# Altium schematic sheet pwr.SchDoc: =ProjectName+'_'+ProjectRevision+'_'+VariantName
size A3; DocumentNumber: 2; SheetNumber: 2; SheetTotal: 5
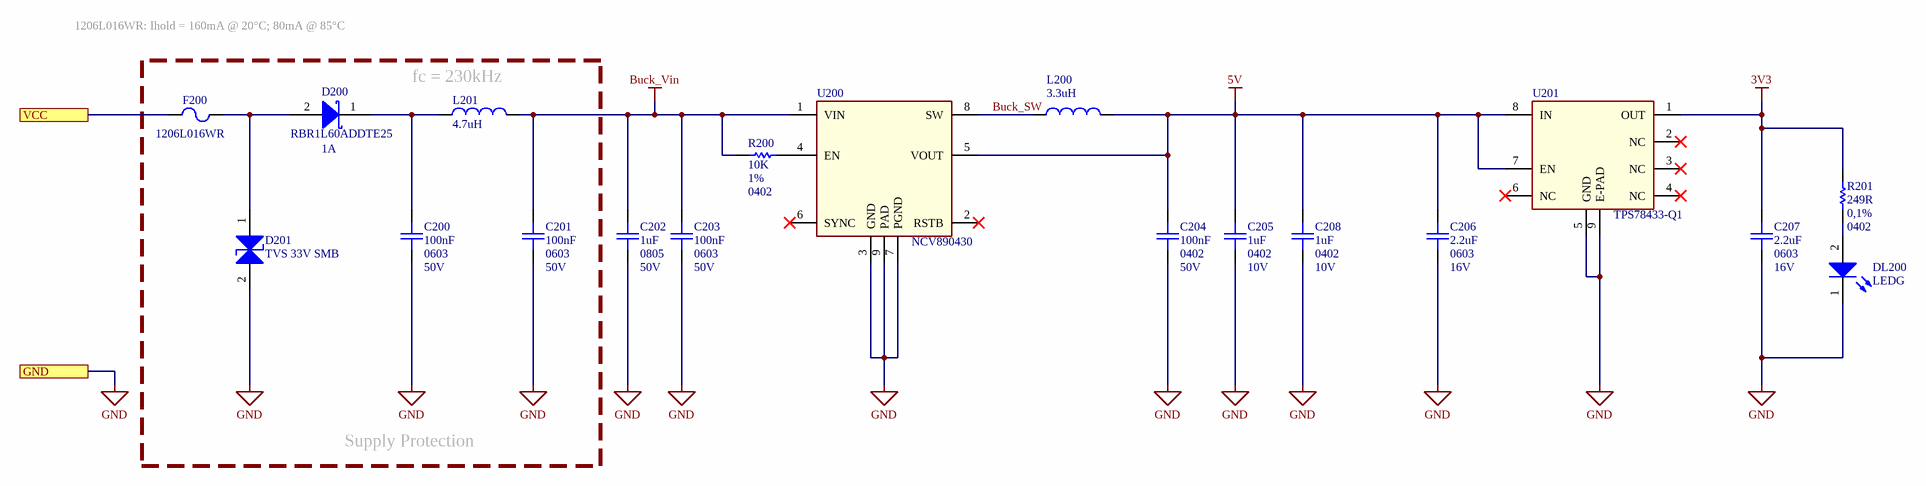
[diagram p0: pwr.SchDoc]

## Parts
C200  Case/Package: 0603  Op Voltage: 50V  [CER0603]  (hidden comment: 100nF)
C201  Case/Package: 0603  Op Voltage: 50V  [CER0603]  (hidden comment: 100nF)
C202  Case/Package: 0805  Op Voltage: 50V  [CER0805]  (hidden comment: 1uF)
C203  Case/Package: 0603  Op Voltage: 50V  [CER0603]  (hidden comment: 100nF)
C204  Case/Package: 0402  Op Voltage: 50V  [CER0402]  (hidden comment: 100nF)
C205  Case/Package: 0402  Op Voltage: 10V  [CER0402]  (hidden comment: 1uF)
C206  Case/Package: 0603  Op Voltage: 16V  [CER0603]  (hidden comment: 2.2uF)
C207  Case/Package: 0603  Op Voltage: 16V  [CER0603]  (hidden comment: 2.2uF)
C208  Case/Package: 0402  Op Voltage: 10V  [CER0402]  (hidden comment: 1uF)
D200  value RBR1L60ADDTE25  If (A): 1A  [DO-214AC_SMA]  (hidden comment: Shottky Rect Diode SMD)
D201  value TVS 33V SMB  [DO-214AA_SMB]  (hidden comment: SMD/PTH TVS Bidirectional Diode)
DL200  value LEDG  [LED SMD 0603]  (hidden comment: Single Color SMD LED)
F200  value 1206L016WR  [FUSC3216X125N]  (hidden comment: Fuse_PTCRes)
L200  value 3.3uH  [WE-MAPI_1212]  (hidden comment: SMD Inductor)
L201  value 4.7uH  [WE-LQ_1210]  (hidden comment: SMD Inductor)
R200  value 10K  Tolerance: 1%  Case/Package: 0402  [Res0402]  (hidden comment: SMD Resistor)
R201  value 249R  Tolerance: 0,1%  Case/Package: 0402  [Res0402]  (hidden comment: SMD Resistor)
U200  value NCV890430  [SON65P300X300X100-9N]  (hidden comment: ONSEMI_NCV890430)
U201  value TPS78433-Q1  [SON65P300X100_HS-9N_NOPAD]  (hidden comment: TI_TPS78533Q_VSON)

## Ports
GND, VCC

## Nets
3V3: C207.1 R201.2 U201.1(OUT)
5V: C204.1 C205.1 C206.1 C208.1 L200.2 U200.5(VOUT) U201.7(EN) U201.8(IN)
Buck_Vin: C201.1 C202.1 C203.1 L201.2 R200.2 U200.1(VIN)
GND: C200.2 C201.2 C202.2 C203.2 C204.2 C205.2 C206.2 C207.2 C208.2 D201.2(K) DL200.1(K) U200.3(GND) U200.7(PGND) U200.9(PAD) U201.5(GND) U201.9(E-PAD) ; port GND
Buck_SW: L200.1 U200.8(SW)
VCC: F200.1 ; port VCC
NetC200_1: C200.1 D200.1(K) L201.1
NetD200_2: D200.2(A) D201.1(A) F200.2
NetDL200_2: DL200.2(A) R201.1
NetR200_1: R200.1 U200.4(EN)

Not connected (* = marked no-connect by the designer): U200 2(RSTB)* 6(SYNC)*; U201 2(NC)* 3(NC)* 4(NC)* 6(NC)*

## Notes on the sheet
- 1206L016WR: Ihold = 160mA @ 20°C; 80mA @ 85°C
- (near L201) fc = 230kHz
- Supply Protection
- Proj
- Title:
- Approved:
- Sheet
- File Name:
- Rev:
- Author:
- Date:
- Size:
- A3
- Number:

## Library data of the parts
C200 C201 C203 = GCM188L81H104KA57D: MLCC Automotive, 100nF, 0603, 50V, 10%, X8L; MFG1: MURATA; Min Op# Temp °C: -55; Max Op# temp °C: 150; Qualification: AEC-Q200; MPN1: GCM188L81H104KA57D; Value: 100nF; MFG2: MURATA; MPN2: GCJ188L8EL104KA07; Tolerance: 10%; Dielectric: X8L; Supplier: Mouser; Supplier Part Number: 81-GCM188L81H104KA7D; Supplier URL: https://www.mouser.it/ProductDetail/Murata-Electronics/GCM188L81H104KA57J?qs=yTuLhIm%2Fv1CdnQNNqnCjYQ%3D%3D; Datasheet URL: https://www.mouser.it/datasheet/2/281/1/GCM188L81H104KA57_01A-3144042.pdf; Termination: Soft (GCJ); Technology: Powertrain/Safety for Automotive
C202 = KAM21KR71H105KL: MLCC Automotive, 1uF, 0805, 50V, 10%, X7R; MFG1: KYOCERA-AVX; Min Op# Temp °C: -55; Max Op# temp °C: 125; Qualification: AEC-Q200; MPN1: KAM21KR71H105KL; Value: 1uF; Tolerance: 10%; Dielectric: X7R; Supplier: Mouser; Supplier Part Number: 581-KAM21KR71H105KL; Supplier URL: https://www.mouser.it/ProductDetail/KYOCERA-AVX/08055C105K4T4A?qs=byeeYqUIh0Oh891bMlItEA%3D%3D; Datasheet URL: https://www.mouser.it/datasheet/2/40/AutoMLCC-2952695.pdf; Technology: Powertrain/Safety for Automotive
C204 = GCM155R71H104KE02D: MLCC Automotive, 100nF, 0402, 50V, 10%, X7r; MFG1: MURATA; Min Op# Temp °C: -55; Max Op# temp °C: 125; Qualification: AEC-Q200; MPN1: GCM155R71H104KE02D; Value: 100nF; MFG2: MURATA; MPN2: GCM155R71H104KE37; Tolerance: 10%; Dielectric: X7R; Supplier: Mouser; Supplier Part Number: 81-GCM155R71H104KE2D; Supplier URL: https://www.mouser.it/ProductDetail/Murata-Electronics/GCM155R71H104KE02D?qs=hNud%2FORuBR2sLZsqfoz4Fw%3D%3D; Datasheet URL: https://www.mouser.it/datasheet/2/281/1/GCM155R71H104KE02_01A-3142168.pdf; Technology: Powertrain/Safety for Automotive
C205 C208 = GCM155C71A105ME38D: MLCC Automotive, 1uF, 0402, 10V, 20%, X7S; MFG1: MURATA; Tolerance: 20.00%; Min Op# Temp °C: -55; Max Op# temp °C: 125; Qualification: AEC-Q200; MPN1: GCM155C71A105ME38D; Value: 1uF; Dielectric: X7S; Supplier: Mouser; Supplier Part Number: 81-GCM155C71A105ME8D; Supplier URL: https://www.mouser.it/it/ProductDetail/Murata-Electronics/GCM155C71A105ME38D?qs=sGAEpiMZZMvsSlwiRhF8qiE2qjJvMbsZOkfRw1uqIZmZq%252BZnnVO3gA%3D%3D; Datasheet URL: https://pim.murata.com/asset/pim4/ceramicCapacitorSMD/GCM155C71A105ME38-01A-EN_PDF_CERAMICCAPACITORSMD
C206 C207 = GRT188C71C225KE13D: MLCC Automotive, 2.2uF, 0603, 16V, 10%, X7S; MFG1: MURATA; Min Op# Temp °C: -55; Max Op# temp °C: 125; Qualification: AEC-Q200; MPN1: GRT188C71C225KE13D; Value: 2.2uF; Tolerance: 10%; Dielectric: X7S; Supplier: Mouser; Supplier Part Number: 81-GRT188C71C225KE3D; Supplier URL: https://www.mouser.it/it/ProductDetail/Murata-Electronics/GRT188C71C225KE13D?qs=hd1VzrDQEGhlNcWcmqnE6Q%3D%3D; Datasheet URL: https://www.mouser.it/datasheet/3/76/1/GRT188C71C225KE13_01A.pdf
D200 = RBR1L60ADDTE25: Schottky Rectifier Diode 1A 60V SMA; MFG1: ROHM; Min Op# Temp °C: -55; Max Op# temp °C: 150; Qualification: AEC-Q101; MPN1: RBR1L60ADDTE25; Vreverse: 60V; Case/Package: SMA(DO-214AC); Supplier: Mouser; Supplier Part Number: 755-RBR1L60ADDTE25; Supplier URL: https://www.mouser.it/it/ProductDetail/ROHM-Semiconductor/RBR1L60ADDTE25?qs=4v%252BiZTmLVHHPf04ac7QKmA%3D%3D; Datasheet URL: https://www.rohm.com/datasheet?p=RBR1L60ADD&dist=Mouser&media=referral&source=mouser.com&campaign=Mouser
D201 = SM6T33CAY: TVS Bidir 33V SMB; MFG1: ST; 10/1000us Power: 0.6Kw; 8/20us Power: 4KW; Stand-Off Voltage: 28.2V; Min Op# Temp °C: -55; Max Op# temp °C: 150; Qualification: AEC-Q101; MPN1: SM6T33CAY; Case/Package: SMB/DO-214AA; Type: Bidirectional; Supplier: Mouser; Supplier Part Number: 511-SM6T33CAY; Supplier URL: https://www.mouser.it/ProductDetail/STMicroelectronics/SM6T33CAY?qs=94V4QatVK%252BdOInZlA3gJmA%3D%3D
DL200 = SML-D12P8WT86C: LED standard - SMD Grn 560nm 6.3mcd 2.2 V, 20mA, 0603 AECQ-102; MFG1: ROHM; Vf: 2V @4mA; Max Current@ Tmax: 4mA; Power Diss (mW): 54mW; Min Op# Temp °C: -40; Max Op# temp °C: 100; Qualification: AEC-Q101; MPN1: SML-D12P8WT86C; Case/Package: 0603-Top View; Color: Green 560nm; Supplier: Mouser; Supplier Part Number: 755-SML-D12P8WT86C; Supplier URL: https://www.mouser.it/ProductDetail/ROHM-Semiconductor/SML-D12P8WT86C?qs=HXFqYaX1Q2wFepzn1zWRrg%3D%3D; Datasheet URL: https://fscdn.rohm.com/en/products/databook/datasheet/opto/led/chip_mono/sml-d12p8wt86(c)-e.pdf; Technology: SM
F200 = 1206L016WR: Resettable Fuse PPTC, 160mA Hold, 370mA Trip, 4.5R min, 30V; MFG1: LITTLEFUSE; Max Resistance: 4.5; Min Op# Temp °C: -40; Max Op# temp °C: 125°; Manufacturer: *; PN: *; Voltage: *; Current: *; MPN1: 1206L016WR; Hold Current: 160mA; Case/Package: 1206; Trip Current: 370mA; Supplier: Mouser; Supplier Part Number: 576-1206L016WR; Supplier URL: https://www.mouser.it/it/ProductDetail/Littelfuse/1206L016WR?qs=PWhpLWeW8weybSDHdny44Q%3D%3D; Datasheet URL: https://www.littelfuse.com/assetdocs/resettable-ptcs-1206l-datasheet?assetguid=2B6A1515-D4EE-4C83-8BD4-152B4901B8F5; Technology: SMD
L200 = 74438333033: Power Inductors - SMD WE-MAPI 3,3uH 1.1A DCR=266mOhms AECQ200; MFG1: WE; Fres (MHz): 38; Rated Current (mA): 1.85; Sat Current (mA): 2.05; Rated Voltage: 80; Min Op# Temp °C: -40; Max Op# temp °C: 125; Qualification: AEC-Q200; MPN1: 74438333033; DCR (mR): 266mOhm; Case/Package: 1212; Supplier: Mouser; Supplier Part Number: 710-74438333033; Supplier URL: https://www.mouser.it/it/ProductDetail/Wurth-Elektronik/74438333033?qs=ZB8tH5z5N7YH5nN%252BUBdrEg%3D%3D; Datasheet URL: https://www.we-online.com/components/products/datasheet/74438333033.pdf; Technology: SMD
L201 = 744032004: EMI Filtering Inductor WE-LQ SMT, 4.7uH, 490mA,; MFG1: WE; Rated Current (mA): 490; Sat Current (mA): 1250; DCR (mR): 280mOhm; Min Op# Temp °C: -40; Max Op# temp °C: 125; MPN1: 744032004; Case/Package: 1210; Supplier: Mouser; Supplier Part Number: 710-744032004; Supplier URL: https://www.mouser.it/it/ProductDetail/Wurth-Elektronik/744032004?qs=XJfXErqHgA4qekdNbV2MtQ%3D%3D; Datasheet URL: https://www.we-online.com/components/products/datasheet/744032004.pdf; Technology: SMD
R200 = CRCW040210K0FKED: Thick Film SM Chip Resistors, 10K, 0402, ±1%, 1/10W; MFG1: VISHAY; Power: 63mW; Temp# Coeffiient (PPM/C): 100; Min Op# Temp °C: -55; Max Op# temp °C: 155; Qualification: AEC-Q200; MPN1: CRCW040210K0FKED; Supplier: Mouser; Supplier Part Number: 71-CRCW0402-10K-E3; Supplier URL: https://www.mouser.it/ProductDetail/Vishay-Dale/CRCW040210K0FKED?qs=rlE3Te1NifyN3e8vvxacSw%3D%3D; Technology: Thick Film
R201 = TNPW0402249RBYEP: Thick Film SM Chip Resistors, 249R, 0402, ±0.1%, 10ppm 1/16W; MFG1: VISHAY; Power: 63mW; Temp# Coeffiient (PPM/C): 10; Min Op# Temp °C: -55; Max Op# temp °C: 155; Qualification: AEC-Q200; MPN1: TNPW0402249RBYEP; Supplier: Mouser; Supplier Part Number: 71-TNPW0402249RBYEP; Supplier URL: https://www.mouser.it/ProductDetail/Vishay-Dale/TNPW0402249RBYEP?qs=iLbezkQI%252Bsgmf6IA3nvojA%3D%3D; Technology: Thick Film
U200 = NCV890430MW50TXG: synchronous buck converter; 3.5-37Vin; 5Vout; 600mA; MFG1: OnSemi; Frequency: 2MHz / 1MHz; Max Duty Cycle: 1; Max Input Voltage: 37V; Min Supply Voltage: 3.5V; Min Op# Temp °C: -40°C; Max Op# temp °C: 150°C; Nominal Output Voltage: 5V; Qualification: AEC-Q100; MPN1: NCV890430MW50TXG; Case/Package: DFN-8; Op Voltage: 3.5-37V; Supplier: Mouser; Supplier Part Number: 863-NCV890430MW50TXG; Supplier URL: https://www.mouser.it/it/ProductDetail/onsemi/NCV890430MW50TXG?qs=OycAS1CGnlh8h8gdwAjytg%3D%3D; Datasheet URL: https://www.onsemi.com/download/data-sheet/pdf/ncv890430-d.pdf; ComponentType: DCDC converter; Max Ouput Current: 600mA; Max Supply Voltage (DC): 37V; Min Input Voltage: 3.5V; Switching Frequency: 2MHz / 1MHz
U201 = TPS78433QWDRBRQ1: TPS784-Q1 Automotive, 3.3V, 300mA, High-PSRR LDO; MFG1: TI; Vin Min (V): 1.7; Vin Max (V): 6V; Out Voltage Accuracy: 0.5%; Dropout @ Imax (V): 0.08; Quiescent cuttent(uA): 25; Min Op# Temp °C: -40; Max Op# temp °C: 150; Qualification: AEC-Q100; MPN1: TPS78433QWDRBRQ1; Case/Package: WSON-8 3x3; Imax (mA): 300mA; Output Type: 3.3V; Supplier: Mouser; Supplier Part Number: 595-TPS78433QWDRBRQ1; Supplier URL: https://www.mouser.it/ProductDetail/Texas-Instruments/TPS78433QWDRBRQ1?qs=iLbezkQI%252BsgJRXPFYNHjvQ%3D%3D; Datasheet URL: https://www.ti.com/lit/gpn/tps784-q1